# EasyEDA schematic SCH_CDE2310_2026-04-19.json
TITLE: Sheet_1; REV: 1.0; Date: 2026-04-19; Sheet: 1/1; Company: Your Company
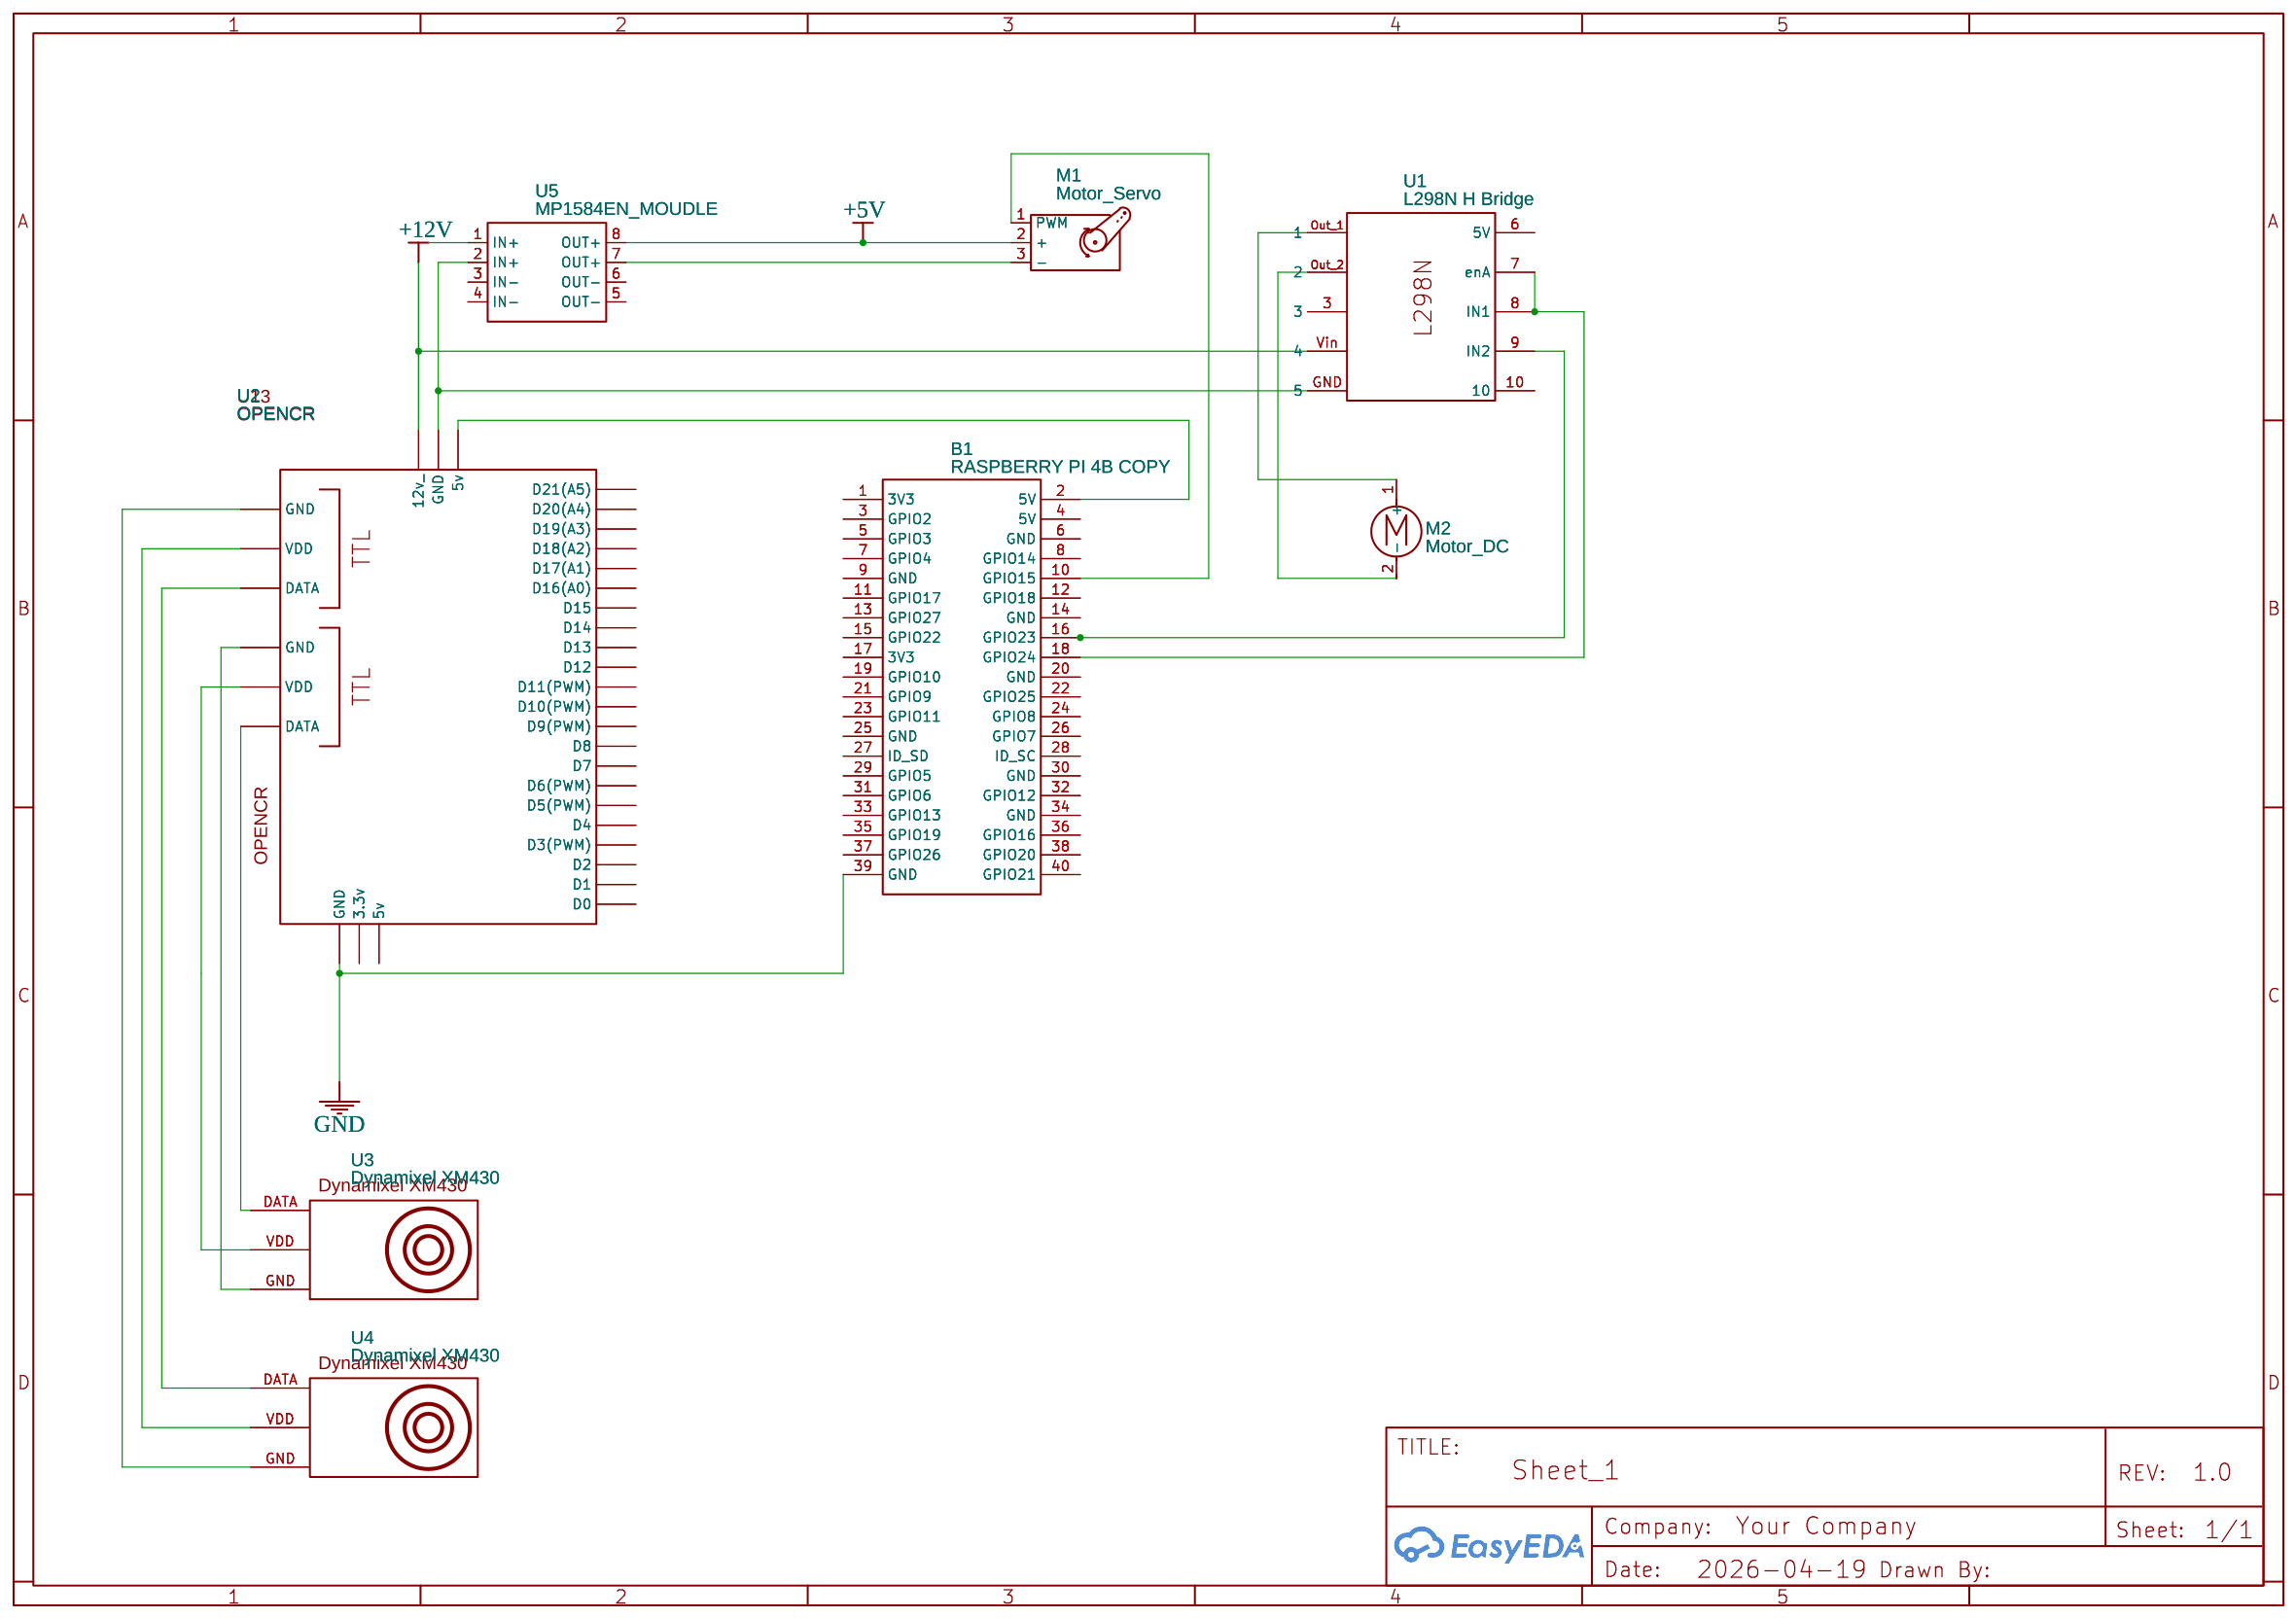
[diagram p0: schematic sheet]

## Parts
B1  RASPBERRY PI 4B COPY  [RASPBERRY_PI_BPLUS_RASPBERRY_PI_B+]
M1  Motor_Servo
M2  Motor_DC  [CONN-TH_2P-P5.08]
U1  L298N H Bridge  [L298N]
U2  OPENCR
U3  Dynamixel XM430
U4  Dynamixel XM430
U5  MP1584EN_MOUDLE  [PWRM-TH_MP1584EN_MOUDLE]

## Library data of the parts
B1 = Raspberry PI 4B: Manufacturer: Raspberry Pi; Supplier Part: Raspberry Pi 4; link: https://www.raspberrypi.com/products/raspberry-pi-4-model-b/; Contributor: laurenzfoto55; subpart_no: 2; Package Display: No
M1 = Motor_Servo: Contributor: KiCAD; license: https://www.gnu.org/licenses/lgpl-2.1.html
M2 = Motor_DC: Contributor: KiCAD; license: https://www.gnu.org/licenses/lgpl-2.1.html
U1 = L298N H Bridge: Contributor: samir42701
U2 = OPENCR: Contributor: uabas
U3 U4 = Dynamixel XM430: Contributor: uabas
U5 = MP1584EN_MOUDLE: Supplier: LCSC; Supplier Part: C9900223542; Manufacturer: null; Manufacturer Part: MP1584EN_moudle; Contributor: lcsc

## Nets
+5V: M1.2(+) U5.8(OUT+)
+12V: B1.2(5V) B1.39(GND) U2.(5v) U3.DATA U3.GND U3.VDD U4.DATA U4.GND U4.VDD U5.2(IN+)
Net-(B1-10): B1.10(GPIO15) M1.1(PWM)
Net-(B1-16): B1.16(GPIO23) U1.9(IN2)
Net-(B1-18): B1.18(GPIO24) U1.7(enA) U1.8(IN1)
Net-(M1-3): M1.3(-) U5.7(OUT+)

Not connected (* = marked no-connect by the designer): B1 1(3V3) 3(GPIO2) 4(5V) 5(GPIO3) 6(GND) 7(GPIO4) 8(GPIO14) 9(GND) 11(GPIO17) 12(GPIO18) 13(GPIO27) 14(GND) 15(GPIO22) 17(3V3) 19(GPIO10) 20(GND) 21(GPIO9) 22(GPIO25) 23(GPIO11) 24(GPIO8) 25(GND) 26(GPIO7) 27(ID_SD) 28(ID_SC) 29(GPIO5) 30(GND) 31(GPIO6) 32(GPIO12) 33(GPIO13) 34(GND) 35(GPIO19) 36(GPIO16) 37(GPIO26) 38(GPIO20) 40(GPIO21); M2 1(+) 2(-); U1 3 6(5V) 10 GND(5) Out 1(1) Out 2(2) Vin(4); U5 1(IN+) 3(IN-) 4(IN-) 5(OUT-) 6(OUT-)
